# Altium project pow_hw_3_V02.00.PrjPcb
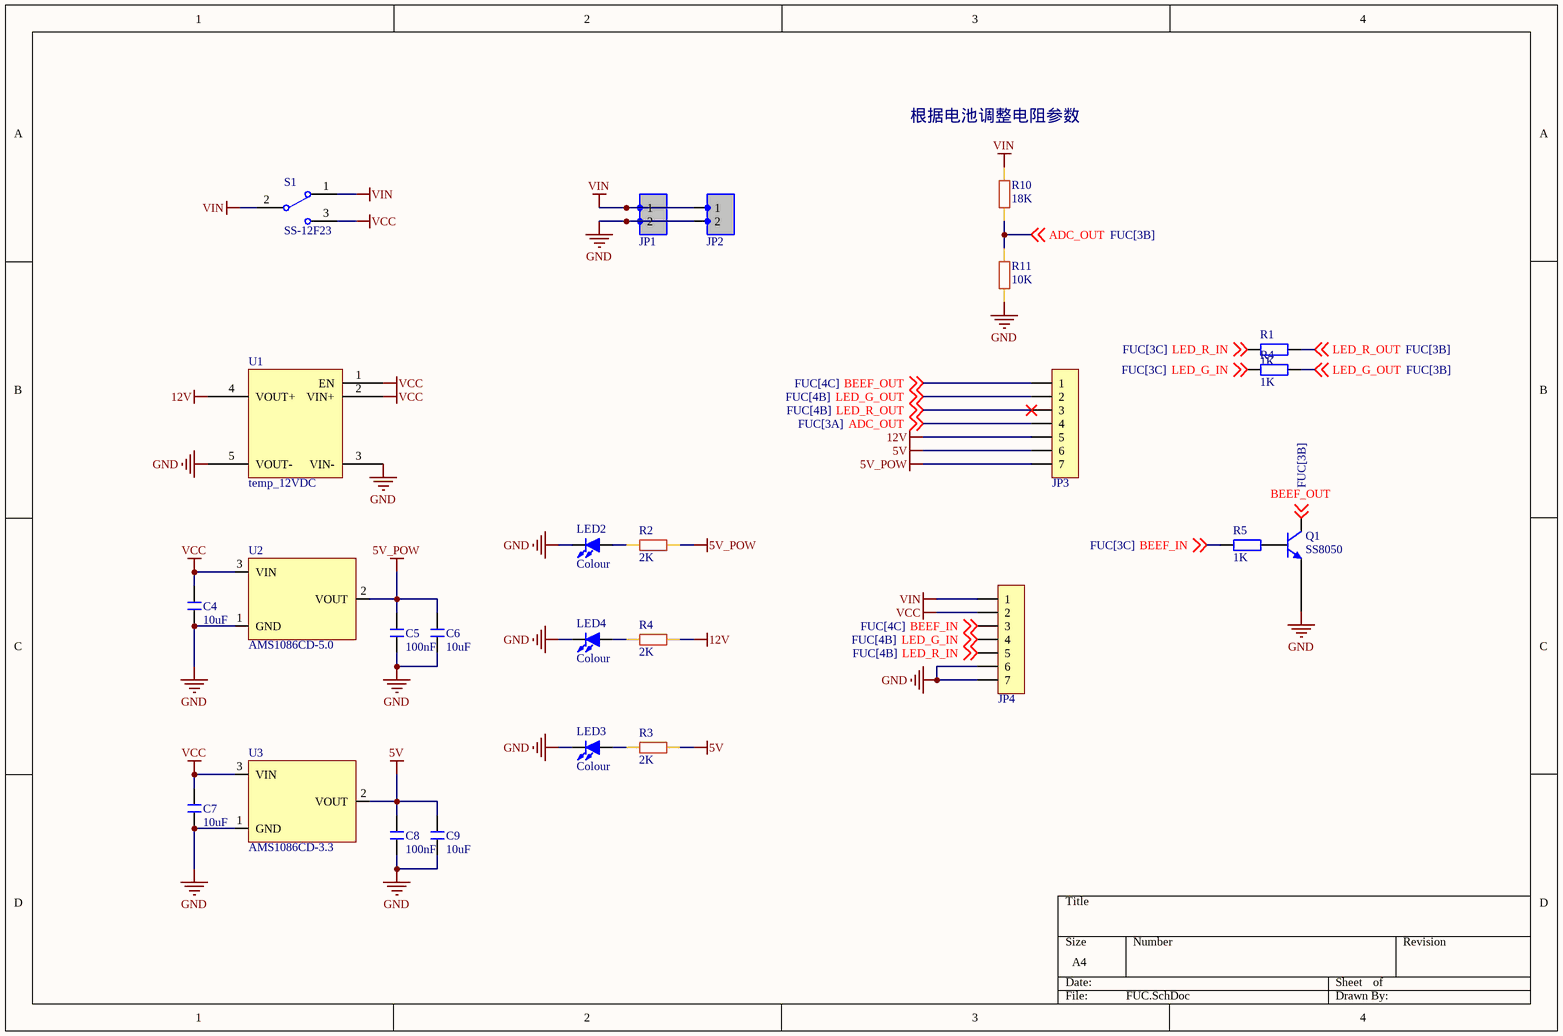
[diagram p0: FUC.SchDoc]
1 sheet, 26 parts. Net scope: global (net labels, ports and power ports of the same name join across sheets).
Board file: pow_hw_3_V02.00.PcbDoc

## Sheet FUC.SchDoc
size A4; SheetNumber: 1; SheetTotal: 1

### Parts
(Parts that share a designator on the sheet are numbered #1, #2 ... from top to bottom, then left to right.)
C4  10uF  [C 0603_L]
C5  100nF  [C 0603_L]
C6  10uF  [C 0603_L]
C7  10uF  [C 0603_L]
C8  100nF  [C 0603_L]
C9  10uF  [C 0603_L]
JP1  HDR-1X2  [XH2.54-WI-2P]  (value not drawn)
JP2  HDR-1X2  [HDR2.54-LI-2P]  (value not drawn)
JP3  HDR-1X7  [HDR2.54-LI-7P]  (value not drawn)
JP4  HDR-1X7  [HDR2.54-LI-7P]  (value not drawn)
LED2  Colour  [LED 0603R]
LED3  Colour  [LED 0603R]
LED4  Colour  [LED 0603R]
Q1  SS8050  [SOT23-3L]
R1  1K  [R 0603_L]
R2  2K  [R 0603_L]
R3  2K  [R 0603_L]
R4#1  1K  [R 0603_L]
R4#2  2K  [R 0603_L]
R5  1K  [R 0603_L]
R10  18K  [R 0603_L]
R11  10K  [R 0603_L]
S1  SS-12F23  [SS-12D10]
U1  temp_12VDC  [TEMP_12VDC]
U2  AMS1086CD-5.0  [TO252]
U3  AMS1086CD-3.3  [TO252]

### Nets
5V: C8.1 C9.1 JP3.6 R3.1 U3.2(VOUT)
5V_POW: C5.1 C6.1 JP3.7 R2.1 U2.2(VOUT)
12V: JP3.5 R4#2.1 U1.4(VOUT+)
GND: C4.2 C5.2 C6.2 C7.2 C8.2 C9.2 JP1.2 JP2.2 JP4.6 JP4.7 LED2.2(K) LED3.2(K) LED4.2(K) Q1.2(E) R11.2 U1.3(VIN-) U1.5(VOUT-) U2.1(GND) U3.1(GND)
VCC: C4.1 C7.1 JP4.2 S1.3 U1.1(EN) U1.2(VIN+) U2.3(VIN) U3.3(VIN)
VIN: JP1.1 JP2.1 JP4.1 R10.1 S1.1 S1.2
ADC_OUT: JP3.4 R10.2 R11.1 ; off-sheet ADC_OUT
BEEF_IN: JP4.3 R5.1 ; off-sheet BEEF_IN
BEEF_OUT: JP3.1 Q1.3(C) ; off-sheet BEEF_OUT
LED_G_IN: JP4.4 R4#1.1 ; off-sheet LED_G_IN
LED_G_OUT: JP3.2 R4#1.2 ; off-sheet LED_G_OUT
LED_R_IN: JP4.5 R1.1 ; off-sheet LED_R_IN
LED_R_OUT: JP3.3 R1.2 ; off-sheet LED_R_OUT
NetLED2_1: LED2.1(A) R2.2
NetLED3_1: LED3.1(A) R3.2
NetLED4_1: LED4.1(A) R4#2.2
NetQ1_1: Q1.1(B) R5.2

### Notes on the sheet
- 根据电池调整电阻参数

### Library data of the parts
C4-C9 = C: 无极性贴片电容; 版权归属: 源创客; BOM名称: 无极性贴片电容; 学习资源: www.ooocke.com
JP1 JP2 = Header 2: 2P接插件; 版权归属: 源创客; BOM名称: 2P接插件; 学习资源: www.ooocke.com
JP3 JP4 = Header 7: 7P接插件; 版权归属: 源创客; BOM名称: 7P接插件; 学习资源: www.ooocke.com
LED2-LED4 = LED-SMD: 贴片LED; 版权归属: 源创客; BOM名称: 贴片LED; 学习资源: www.ooocke.com
Q1 = 8050-SMD: 高频放大-NPN型; 版权归属: 源创客; 属性: 40V 1.5A 1W 100MHZ; BOM名称: 高频放大-NPN型; 学习资源: www.ooocke.com
R1 R4#1 R5 = R: 贴片电阻; 版权归属: 源创客; BOM名称: 贴片电阻; 学习资源: www.ooocke.com
R2 R3 R4#2 R10 R11 = 电阻: 贴片电阻1%精度
S1 = SSW-1P: 1路拨动开关; BOM名称: 波动开关; 版权归属: 源创客; 学习资源: www.ooocke.com
U1 = temp_12VDC: 通用升降压模块
U3 = AMS1086CD-5.0